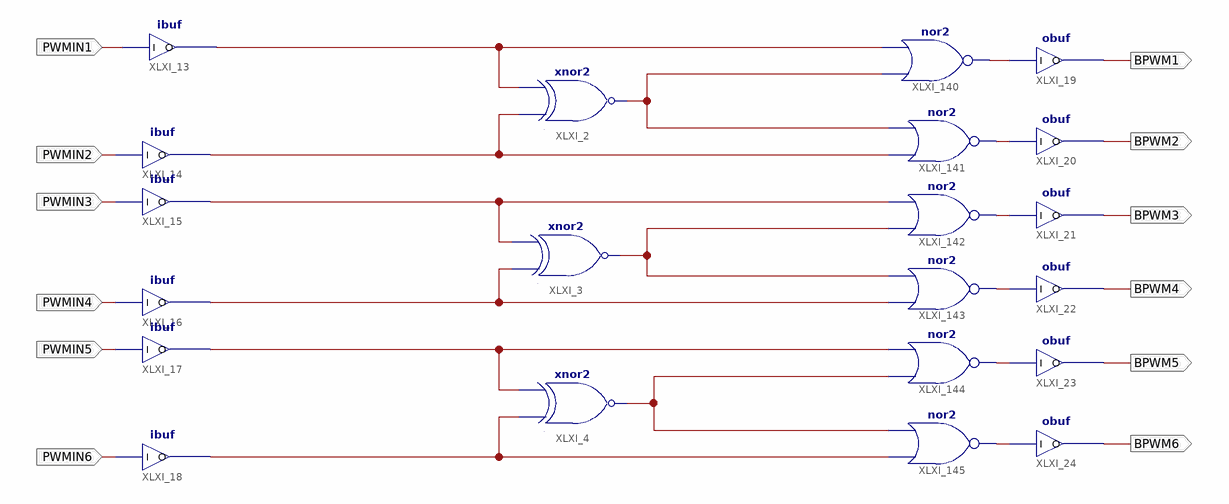
[diagram p0: schematic sheet 1]
// Xilinx ISE schematic MotorPhaseInterlock.sch (xbr) as structural Verilog: 21 symbols, 12 ports
module MotorPhaseInterlock (
  input  PWMIN1,
  input  PWMIN2,
  input  PWMIN3,
  input  PWMIN4,
  input  PWMIN5,
  input  PWMIN6,
  output BPWM2,
  output BPWM4,
  output BPWM5,
  output BPWM6,
  output BPWM1,
  output BPWM3
);

  wire XLXN_1, XLXN_4, XLXN_7, XLXN_21, XLXN_23, XLXN_159, XLXN_176, XLXN_180, XLXN_181, XLXN_213, XLXN_246,
       XLXN_248, XLXN_252, XLXN_253, XLXN_254;

  xnor XLXI_2 (XLXN_1, XLXN_246, XLXN_252);
  xnor XLXI_4 (XLXN_4, XLXN_248, XLXN_254);
  xnor XLXI_3 (XLXN_7, XLXN_159, XLXN_253);
  ibuf XLXI_14 (.I(PWMIN2), .O(XLXN_246));
  ibuf XLXI_15 (.I(PWMIN3), .O(XLXN_253));
  ibuf XLXI_16 (.I(PWMIN4), .O(XLXN_159));
  ibuf XLXI_17 (.I(PWMIN5), .O(XLXN_254));
  ibuf XLXI_18 (.I(PWMIN6), .O(XLXN_248));
  ibuf XLXI_13 (.I(PWMIN1), .O(XLXN_252));
  nor XLXI_141 (XLXN_21, XLXN_246, XLXN_1);
  nor XLXI_143 (XLXN_23, XLXN_159, XLXN_7);
  nor XLXI_144 (XLXN_180, XLXN_4, XLXN_254);
  nor XLXI_145 (XLXN_181, XLXN_248, XLXN_4);
  nor XLXI_142 (XLXN_176, XLXN_7, XLXN_253);
  obuf XLXI_19 (.I(XLXN_213), .O(BPWM1));
  nor XLXI_140 (XLXN_213, XLXN_1, XLXN_252);
  obuf XLXI_20 (.I(XLXN_21), .O(BPWM2));
  obuf XLXI_21 (.I(XLXN_176), .O(BPWM3));
  obuf XLXI_22 (.I(XLXN_23), .O(BPWM4));
  obuf XLXI_23 (.I(XLXN_180), .O(BPWM5));
  obuf XLXI_24 (.I(XLXN_181), .O(BPWM6));

  // Notes on the sheet:
  //   LOC on signal BPWM2 = P22
  //   LOC on signal BPWM4 = P20
  //   LOC on signal BPWM5 = P26
  //   LOC on signal BPWM6 = P19
  //   LOC on signal PWMIN1 = P43
  //   LOC on signal PWMIN2 = P2
  //   LOC on signal PWMIN3 = P44
  //   LOC on signal PWMIN4 = P3
  //   LOC on signal PWMIN5 = P1
  //   LOC on signal PWMIN6 = P4
  //   LOC on signal BPWM1 = P28
  //   LOC on signal BPWM3 = P27
endmodule
